# Altium project AirPurity.PrjPcb
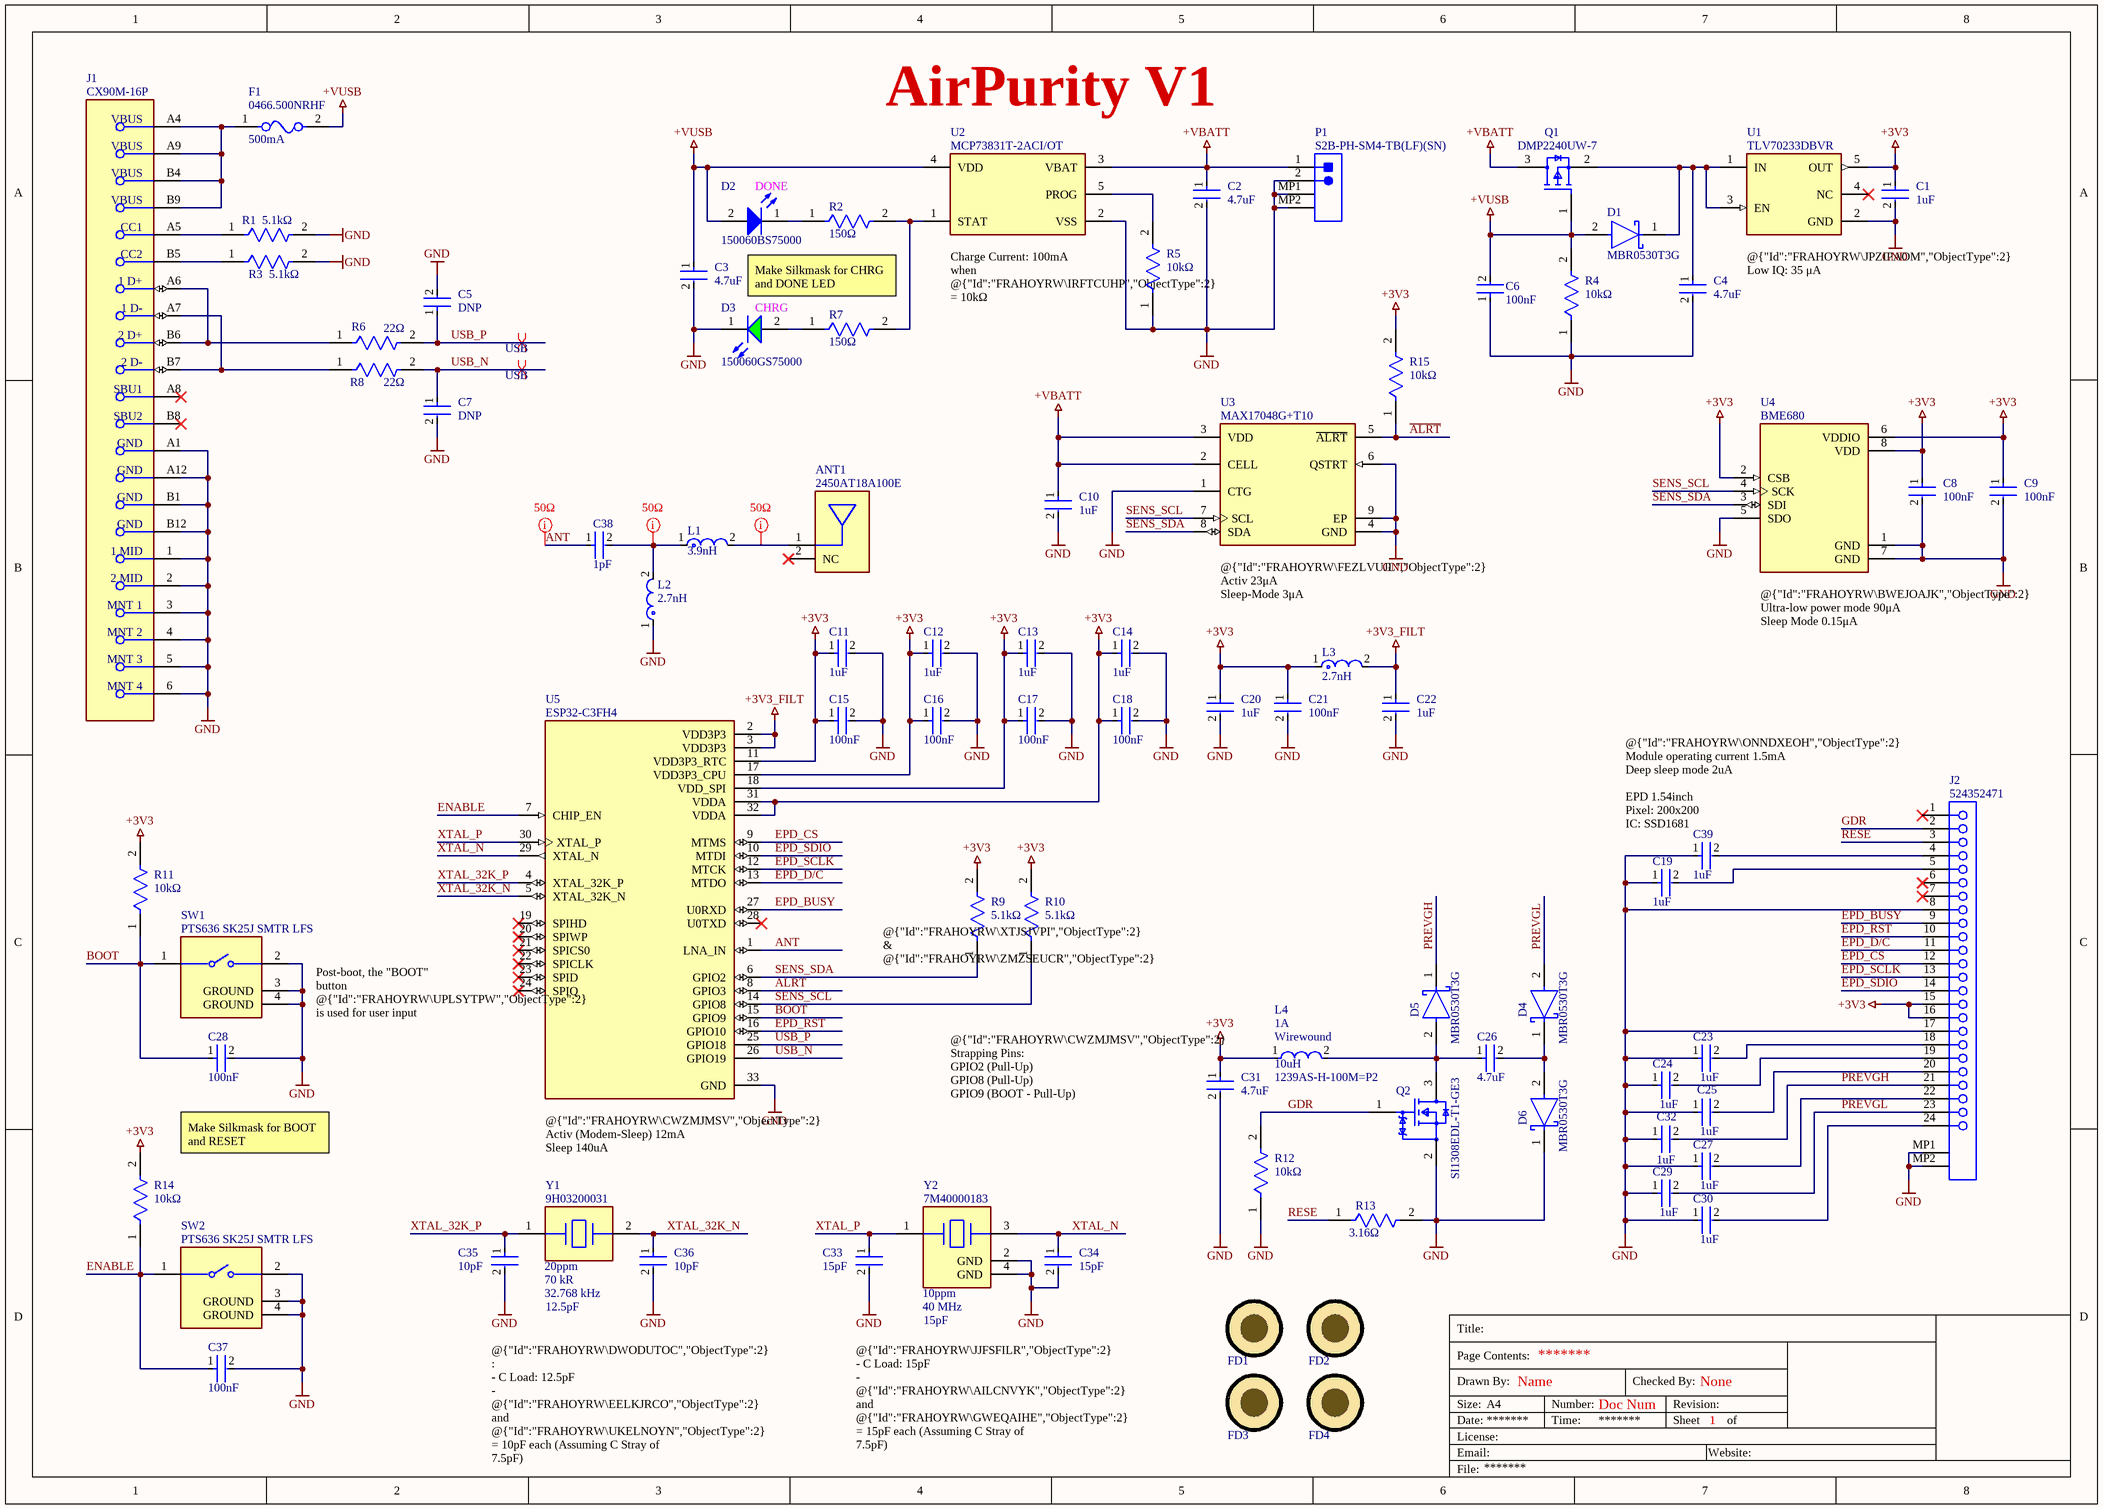
[diagram p0: AirPurity_V1.SchDoc]
1 sheet, 84 parts. Net scope: global (net labels, ports and power ports of the same name join across sheets).
Board file: AirPurity.PcbDoc

## Sheet AirPurity_V1.SchDoc: AirPurity V1
size A3; Date: *******; ApprovedBy: *******; CheckedBy: None; Author: Annoyedmilk; CompanyName: *******; DrawnBy: Name; Engineer: *******; Organization: *******; Address1: *******; Address2: *******; Address3: *******; Address4: *******; DocumentNumber: Doc Num; Revision: *******; SheetNumber: 1; SheetTotal: 1; CurrentTime: *******; CurrentDate: *******; DocumentFullPathAndName: *******; DocumentName: *******; ModifiedDate: *******; ImagePath: C:\Users\marco\Documents\GitHub\AirPurity\logo\AirPurity; ProjectName: *******; Application_BuildNumber: *******

### Parts
ANT1  Manufacturer Part Number: 2450AT18A100E  [FP-2450AT18A0100001E-MFG]  (hidden comment: 2450AT18A100)
C1  Capacitance: 1uF  [GRM155-0402-MFG]  (hidden comment: GRM155R61E105KA12D)
C2  Capacitance: 4.7uF  [GRM155-0402-MFG]  (hidden comment: GRM155R61E475ME15D)
C3  Capacitance: 4.7uF  [GRM155-0402-MFG]  (hidden comment: GRM155R61E475ME15D)
C4  Capacitance: 4.7uF  [GRM155-0402-MFG]  (hidden comment: GRM155R61E475ME15D)
C5  Capacitance: DNP  [GRM033-0201-MFG]  (hidden comment: GRM0335C1H150FA01D)
C6  Capacitance: 100nF  [GRM033-0201-MFG]  (hidden comment: GRM033R61A104KE15D)
C7  Capacitance: DNP  [GRM033-0201-MFG]  (hidden comment: GRM0335C1H150FA01D)
C8  Capacitance: 100nF  [GRM033-0201-MFG]  (hidden comment: GRM033R61A104KE15D)
C9  Capacitance: 100nF  [GRM033-0201-MFG]  (hidden comment: GRM033R61A104KE15D)
C10  Capacitance: 1uF  [GRM155-0402-MFG]  (hidden comment: GRM155R61E105KA12D)
C11  Capacitance: 1uF  [GRM155-0402-MFG]  (hidden comment: GRM155R61E105KA12D)
C12  Capacitance: 1uF  [GRM155-0402-MFG]  (hidden comment: GRM155R61E105KA12D)
C13  Capacitance: 1uF  [GRM155-0402-MFG]  (hidden comment: GRM155R61E105KA12D)
C14  Capacitance: 1uF  [GRM155-0402-MFG]  (hidden comment: GRM155R61E105KA12D)
C15  Capacitance: 100nF  [GRM033-0201-MFG]  (hidden comment: GRM033R61A104KE15D)
C16  Capacitance: 100nF  [GRM033-0201-MFG]  (hidden comment: GRM033R61A104KE15D)
C17  Capacitance: 100nF  [GRM033-0201-MFG]  (hidden comment: GRM033R61A104KE15D)
C18  Capacitance: 100nF  [GRM033-0201-MFG]  (hidden comment: GRM033R61A104KE15D)
C19  Capacitance: 1uF  [GRM155-0402-MFG]  (hidden comment: GRM155R61E105KA12D)
C20  Capacitance: 1uF  [GRM155-0402-MFG]  (hidden comment: GRM155R61E105KA12D)
C21  Capacitance: 100nF  [GRM033-0201-MFG]  (hidden comment: GRM033R61A104KE15D)
C22  Capacitance: 1uF  [GRM155-0402-MFG]  (hidden comment: GRM155R61E105KA12D)
C23  Capacitance: 1uF  [GRM155-0402-MFG]  (hidden comment: GRM155R61E105KA12D)
C24  Capacitance: 1uF  [GRM155-0402-MFG]  (hidden comment: GRM155R61E105KA12D)
C25  Capacitance: 1uF  [GRM155-0402-MFG]  (hidden comment: GRM155R61E105KA12D)
C26  Capacitance: 4.7uF  [GRM155-0402-MFG]  (hidden comment: GRM155R61E475ME15D)
C27  Capacitance: 1uF  [GRM155-0402-MFG]  (hidden comment: GRM155R61E105KA12D)
C28  Capacitance: 100nF  [GRM033-0201-MFG]  (hidden comment: GRM033R61A104KE15D)
C29  Capacitance: 1uF  [GRM155-0402-MFG]  (hidden comment: GRM155R61E105KA12D)
C30  Capacitance: 1uF  [GRM155-0402-MFG]  (hidden comment: GRM155R61E105KA12D)
C31  Capacitance: 4.7uF  [GRM155-0402-MFG]  (hidden comment: GRM155R61E475ME15D)
C32  Capacitance: 1uF  [GRM155-0402-MFG]  (hidden comment: GRM155R61E105KA12D)
C33  Capacitance: 15pF  [GRM033-0201-MFG]  (hidden comment: GRM0335C1H150FA01D)
C34  Capacitance: 15pF  [GRM033-0201-MFG]  (hidden comment: GRM0335C1H150FA01D)
C35  Capacitance: 10pF  [GRM033-0201-MFG]  (hidden comment: GRM0335C1H100JA01D)
C36  Capacitance: 10pF  [GRM033-0201-MFG]  (hidden comment: GRM0335C1H100JA01D)
C37  Capacitance: 100nF  [GRM033-0201-MFG]  (hidden comment: GRM033R61A104KE15D)
C38  Capacitance: 1pF  [GRM033-0201-MFG]  (hidden comment: GRM0335C1H1R0BA01D)
C39  Capacitance: 1uF  [GRM155-0402-MFG]  (hidden comment: GRM155R61E105KA12D)
D1  MBR0530T3G  [425-04-MFG]
D2  150060BS75000  [0603_150060xx75000]
D3  150060GS75000  [0603_150060xx75000]
D4  MBR0530T3G  [425-04-MFG]
D5  MBR0530T3G  [425-04-MFG]
D6  MBR0530T3G  [425-04-MFG]
F1  Current: 500mA  [0466-MFG]  (hidden comment: 0466.500NRHF)
FD1  Fiducial  [FIDUCIAL-1MM]  (value not drawn)
FD2  Fiducial  [FIDUCIAL-1MM]  (value not drawn)
FD3  Fiducial  [FIDUCIAL-1MM]  (value not drawn)
FD4  Fiducial  [FIDUCIAL-1MM]  (value not drawn)
J1  CX90M-16P  [CX90M-16P-MFG]
J2  524352471  [52435-2471]
L1  Inductance: 3.9nH  [LQP03TG-MFG]  (hidden comment: LQP03TN3N9B02D)
L2  Inductance: 2.7nH  [LQP03TG-MFG]  (hidden comment: LQP03TG2N7C02D)
L3  Inductance: 2.7nH  [LQP03TG-MFG]  (hidden comment: LQP03TG2N7C02D)
L4  Current Rating: 1A  Resistor Type: Wirewound  Inductance: 10uH  [DFE252012C-MFG]  (hidden comment: 1239AS-H-100M=P2)
P1  S2B-PH-SM4-TB(LF)(SN)  [JST- S2B-PH-SM4-TB(LF)(SN)]
Q1  DMP2240UW-7  [SOT323-MFG]
Q2  SI1308EDL-T1-GE3  [5549-MFG]
R1  Resistance: 5.1kΩ  [RC0402-MFG]  (hidden comment: RC0402FR-075K1L)
R2  Resistance: 150Ω  [RC0402-MFG]  (hidden comment: RC0402FR-07150RL)
R3  Resistance: 5.1kΩ  [RC0402-MFG]  (hidden comment: RC0402FR-075K1L)
R4  Resistance: 10kΩ  [RC0402-MFG]  (hidden comment: RC0402FR-0710KL)
R5  Resistance: 10kΩ  [RC0402-MFG]  (hidden comment: RC0402FR-0710KL)
R6  Resistance: 22Ω  [RC0402-MFG]  (hidden comment: RC0402FR-0722RL)
R7  Resistance: 150Ω  [RC0402-MFG]  (hidden comment: RC0402FR-07150RL)
R8  Resistance: 22Ω  [RC0402-MFG]  (hidden comment: RC0402FR-0722RL)
R9  Resistance: 5.1kΩ  [RC0402-MFG]  (hidden comment: RC0402FR-075K1L)
R10  Resistance: 5.1kΩ  [RC0402-MFG]  (hidden comment: RC0402FR-075K1L)
R11  Resistance: 10kΩ  [RC0402-MFG]  (hidden comment: RC0402FR-0710KL)
R12  Resistance: 10kΩ  [RC0402-MFG]  (hidden comment: RC0402FR-0710KL)
R13  Resistance: 3.16Ω  [RC0402-MFG]  (hidden comment: RC0402FR-073R16L)
R14  Resistance: 10kΩ  [RC0402-MFG]  (hidden comment: RC0402FR-0710KL)
R15  Resistance: 10kΩ  [RC0402-MFG]  (hidden comment: RC0402FR-0710KL)
SW1  PTS636 SK25J SMTR LFS  [PTS636_SKG25_SMTR_LFS-MFG]
SW2  PTS636 SK25J SMTR LFS  [PTS636_SKG25_SMTR_LFS-MFG]
U1  TLV70233DBVR  [DBV0005A-MFG]
U2  MCP73831T-2ACI/OT  [SOT23-5LD-PL-1-MFG]
U3  MAX17048G+T10  [T822-3-MFG]
U4  BME680  [PSON80P300X300X100-8N]
U5  ESP32-C3FH4  [QFN50P500X500X90-33N]
Y1  Frequency Tolerance: 20ppm  Equivalent Series Resistance: 70 kR  Frequency: 32.768 kHz  Load Capacitance: 12.5pF  [ABS10]  (hidden comment: 9H03200031)
Y2  Frequency Tolerance: 10ppm  Frequency: 40 MHz  Load Capacitance: 15pF  [ABM8]  (hidden comment: 7M40000183)

### Nets
+3V3: C1.1 C8.1 C9.1 C11.1 C12.1 C13.1 C14.1 C15.1 C16.1 C17.1 C18.1 C20.1 C21.1 C31.1 J2.15 J2.16 L3.1 L4.1 R9.2 R10.2 R11.2 R14.2 R15.2 U1.5(OUT) U4.2(CSB) U4.6(VDDIO) U4.8(VDD) U5.11(VDD3P3_RTC) U5.17(VDD3P3_CPU) U5.18(VDD_SPI) U5.31(VDDA) U5.32(VDDA)
+3V3_FILT: C22.1 L3.2 U5.2(VDD3P3) U5.3(VDD3P3)
+VBATT: C2.1 C10.1 P1.1 Q1.3(D) U2.3(VBAT) U3.2(CELL) U3.3(VDD)
+VUSB: C3.1 C6.2 D1.2(A) D2.2(A) F1.2 Q1.1(G) R4.2 U2.4(VDD)
GND: C1.2 C2.2 C3.2 C4.2 C5.2 C6.1 C7.2 C8.2 C9.2 C10.2 C11.2 C12.2 C13.2 C14.2 C15.2 C16.2 C17.2 C18.2 C19.1 C20.2 C21.2 C22.2 C23.1 C24.1 C25.1 C27.1 C28.2 C29.1 C30.1 C31.2 C32.1 C33.2 C34.2 C35.2 C36.2 C37.2 C39.1 D3.1(K) D6.1(C) J1.1(1_MID) J1.2(2_MID) J1.3(MNT_1) J1.4(MNT_2) J1.5(MNT_3) J1.6(MNT_4) J1.A1(GND) J1.A12(GND) J1.B1(GND) J1.B12(GND) J2.8 J2.17 J2.MP1 J2.MP2 L2.1 P1.2 P1.MP1 P1.MP2 Q2.2(S) R1.2 R3.2 R4.1 R5.1 R12.1 R13.2 SW1.2 SW1.3(GROUND) SW1.4(GROUND) SW2.2 SW2.3(GROUND) SW2.4(GROUND) U1.2(GND) U2.2(VSS) U3.1(CTG) U3.4(GND) U3.6(QSTRT) U3.9(EP) U4.1(GND) U4.5(SDO) U4.7(GND) U5.33(GND) Y2.2(GND) Y2.4(GND)
~{ALRT}: R15.1 U3.5(~{ALRT}) U5.8(GPIO3)
ANT: C38.1 U5.1(LNA_IN)
BOOT: C28.1 R11.1 SW1.1 U5.15(GPIO9)
ENABLE: C37.1 R14.1 SW2.1 U5.7(CHIP_EN)
EPD_BUSY: J2.9 U5.27(U0RXD)
EPD_CS: J2.12 U5.9(MTMS)
EPD_D/C: J2.11 U5.13(MTDO)
EPD_RST: J2.10 U5.16(GPIO10)
EPD_SCLK: J2.13 U5.12(MTCK)
EPD_SDIO: J2.14 U5.10(MTDI)
GDR: J2.2 Q2.1(G) R12.2
PREVGH: C32.2 D5.1(C) J2.21
PREVGL: C29.2 D4.2(A) J2.23
RESE: J2.3 R13.1
SENS_SCL: R10.1 U3.7(SCL) U4.4(SCK) U5.14(GPIO8)
SENS_SDA: R9.1 U3.8(SDA) U4.3(SDI) U5.6(GPIO2)
USB_N: C7.1 R8.2 U5.26(GPIO19)
USB_P: C5.1 R6.2 U5.25(GPIO18)
XTAL_32K_N: C36.1 U5.5(XTAL_32K_N) Y1.2
XTAL_32K_P: C35.1 U5.4(XTAL_32K_P) Y1.1
XTAL_N: C34.1 U5.29(XTAL_N) Y2.3
XTAL_P: C33.1 U5.30(XTAL_P) Y2.1
NetANT1_1: ANT1.1(FEED) L1.2
NetC4_1: C4.1 D1.1(C) Q1.2(S) U1.1(IN) U1.3(EN)
NetC19_2: C19.2 J2.5
NetC23_2: C23.2 J2.18
NetC24_2: C24.2 J2.19
NetC25_2: C25.2 J2.20
NetC26_1: C26.1 D5.2(A) L4.2 Q2.3(D)
NetC26_2: C26.2 D4.1(C) D6.2(A)
NetC27_2: C27.2 J2.22
NetC30_2: C30.2 J2.24
NetC38_2: C38.2 L1.1 L2.2
NetC39_2: C39.2 J2.4
NetD2_1: D2.1(K) R2.1
NetD3_2: D3.2(A) R7.1
NetF1_1: F1.1 J1.A4(VBUS) J1.A9(VBUS) J1.B4(VBUS) J1.B9(VBUS)
NetJ1_A5: J1.A5(CC1) R1.1
NetJ1_A6: J1.A6(1_D+) J1.B6(2_D+) R6.1
NetJ1_A7: J1.A7(1_D-) J1.B7(2_D-) R8.1
NetJ1_B5: J1.B5(CC2) R3.1
NetR2_2: R2.2 R7.2 U2.1(STAT)
NetR5_2: R5.2 U2.5(PROG)

Not connected (* = marked no-connect by the designer): ANT1 2(NC)*; J1 A8(SBU1)* B8(SBU2)*; J2 1* 6* 7*; U1 4(NC)*; U5 19(SPIHD)* 20(SPIWP)* 21(SPICS0)* 22(SPICLK)* 23(SPID)* 24(SPIQ)* 28(U0TXD)*

### Layout directives
differential pair; differential pair class USB: USB_N, USB_P
net class 50Ohm: ANT, NetANT1_1, NetC38_2

### Notes on the sheet
- (near D2) DONE
- Make Silkmask for CHRG and DONE LED
- (near D3) CHRG
- (near U2) Charge Current: 100mA
  when @{"Id":"FRAHOYRW\IRFTCUHP","ObjectType":2} = 10kΩ
- (near U1) @{"Id":"FRAHOYRW\JPZIPAOM","ObjectType":2}
  Low IQ: 35 μA
- (near U3) @{"Id":"FRAHOYRW\FEZLVUJL","ObjectType":2}
  Activ 23μA Sleep-Mode 3μA
- (near U4) @{"Id":"FRAHOYRW\BWEJOAJK","ObjectType":2}
  Ultra-low power mode 90μA Sleep Mode 0.15μA
- (near C39) @{"Id":"FRAHOYRW\ONNDXEOH","ObjectType":2}
  Module operating current 1.5mA
  Deep sleep mode 2uA
  EPD 1.54inch
  Pixel: 200x200
  IC: SSD1681
- (near R9) @{"Id":"FRAHOYRW\XTJSJVPI","ObjectType":2} & @{"Id":"FRAHOYRW\ZMZSEUCR","ObjectType":2} I2C Pull-Up
- Post-boot, the "BOOT" button @{"Id":"FRAHOYRW\UPLSYTPW","ObjectType":2} is used for user input
- @{"Id":"FRAHOYRW\CWZMJMSV","ObjectType":2}
  Strapping Pins:
  GPIO2 (Pull-Up)
  GPIO8 (Pull-Up)
  GPIO9 (BOOT - Pull-Up)
- Make Silkmask for BOOT and RESET
- (near U5) @{"Id":"FRAHOYRW\CWZMJMSV","ObjectType":2}
  Activ (Modem-Sleep) 12mA
  Sleep 140uA
- @{"Id":"FRAHOYRW\DWODUTOC","ObjectType":2} :
  - C Load: 12.5pF
  - @{"Id":"FRAHOYRW\EELKJRCO","ObjectType":2} and @{"Id":"FRAHOYRW\UKELNOYN","ObjectType":2} = 10pF each (Assuming C Stray of 7.5pF)
- @{"Id":"FRAHOYRW\JJFSFILR","ObjectType":2}
  - C Load: 15pF
  - @{"Id":"FRAHOYRW\AILCNVYK","ObjectType":2} and @{"Id":"FRAHOYRW\GWEQAIHE","ObjectType":2} = 15pF each (Assuming C Stray of 7.5pF)
- Title:
- Drawn By:
- Page Contents:
- Checked By:
- Size:
- Date:
- File:
- License:
- Email:
- A4
- Number:
- Time:
- Revision:
- Sheet
- Website:
- of

### Library data of the parts
ANT1 = 2450AT18A100: Chip Antenna 0.5dBi 2.4GHz 2W 1206; Impedance: 50Ω; LCSC Part Number: C89334
C1 C10-C14 C19 C20 C22-C25 C27 C29 C30 C32 C39 = GRM155R61E105KA12D: 1uF X5R 0402 Multilayer Ceramic Capacitor; LCSC Part Number: C77009; Manufacturer Part Number: GRM155R61E105KA12D
C2-C4 C26 C31 = GRM155R61E475ME15D: 4.7uF X5R 0402 Multilayer Ceramic Capacitor; LCSC Part Number: C2858031; Manufacturer Part Number: GRM155R61E475ME15D
C5 C7 C33 C34 = GRM0335C1H150FA01D: 15pF C0G 0201 Multilayer Ceramic Capacitor; LCSC Part Number: C237567; Manufacturer Part Number: GRM0335C1H150FA01D
C6 C8 C9 C15-C18 C21 C28 C37 = GRM033R61A104KE15D: 100nF X5R 0201 Multilayer Ceramic Capacitor; LCSC Part Number: C76934; Manufacturer Part Number: GRM033R61A104KE15D
C35 C36 = GRM0335C1H100JA01D: 10pF C0G 0201 Multilayer Ceramic Capacitor; LCSC Part Number: C76921; Manufacturer Part Number: GRM0335C1H100JA01D
C38 = GRM0335C1H1R0BA01D: 1pF C0G 0201 Multilayer Ceramic Capacitor; LCSC Part Number: C85893; Manufacturer Part Number: GRM0335C1H1R0BA01D
D1 D4-D6 = MBR0530T3G: Schottky Barrier Diodes; LCSC Part Number: C236079; Manufacturer Part Number: MBR0530T3G
D2 = 150060BS75000: LED Blue 3.2V 0603; Forward Voltage: 3.2V; Color: Blue; LCSC Part Number: C5197644; Manufacturer Part Number: 150060BS75000
D3 = 150060GS75000: LED Emerald 3.2V 0603; Color: Green; Forward Voltage: 3.2V; LCSC Part Number: C5252984; Manufacturer Part Number: 150060GS75000
F1 = 0466.500NRHF: Fuse 500mA; LCSC Part Number: C151133; Manufacturer Part Number: 0466.500NRHF
J1 = CX90M-16P: Connector USB2.0 TYPE-C 16POS; LCSC Part Number: C2889324; Manufacturer Part Number: CX90M-16P
J2 = 524352471: FPC Connector, 2.0 mm, 0.5 mm, Right Angle; LCSC Part Number: C122394; Manufacturer Part Number: 524352471
L1 = LQP03TN3N9B02D: Inductor 3.9nH; Current Rating: 400mA; LCSC Part Number: C77115; Manufacturer Part Number: LQP03TN3N9B02D
L2 L3 = LQP03TG2N7C02D: Inductor 2.7nH; Current Rating: 450mA; LCSC Part Number: C337946; Manufacturer Part Number: LQP03TG2N7C02D
L4 = 1239AS-H-100M=P2: Inductor 10uH; LCSC Part Number: C237599; Manufacturer Part Number: 1239AS-H-100M=P2
P1 = S2B-PH-SM4-TB(LF)(SN): Male Header, Pitch 2 mm, 1 x 2 Position; LCSC Part Number: C295747; Manufacturer Part Number: S2B-PH-SM4-TB(LF)(SN)
Q1 = DMP2240UW-7: MOSFET P-Channel; LCSC Part Number: C459548; Manufacturer Part Number: DMP2240UW-7
Q2 = SI1308EDL-T1-GE3: MOSFET N-Channel; LCSC Part Number: C469327; Manufacturer Part Number: SI1308EDL-T1-GE3
R1 R3 R9 R10 = RC0402FR-075K1L: 5.1kΩ 0402 Chip Resistor; LCSC Part Number: C105872; Manufacturer Part Number: RC0402FR-075K1L
R2 R7 = RC0402FR-07150RL: 150Ω 0402 Chip Resistor; LCSC Part Number: C138054; Manufacturer Part Number: RC0402FR-07150RL
R4 R5 R11 R12 R14 R15 = RC0402FR-0710KL: 10kΩ 0402 Chip Resistor; LCSC Part Number: C60490; Manufacturer Part Number: RC0402FR-0710KL
R6 R8 = RC0402FR-0722RL: 22Ω 0402 Chip Resistor; LCSC Part Number: C114765; Manufacturer Part Number: RC0402FR-0722RL
R13 = RC0402FR-073R16L: 3.16Ω 0402 Chip Resistor; LCSC Part Number: C477688; Manufacturer Part Number: RC0402FR-073R16L
SW1 SW2 = PTS636 SK25J SMTR LFS: Tactile Switch SPST; LCSC Part Number: C2800965; Manufacturer Part Number: PTS636 SK25J SMTR LFS
U1 = TLV70233DBVR: LDO Voltage Regulators 300mALow IQLDO Reg; LCSC Part Number: C26833; Manufacturer Part Number: TLV70233DBVR
U2 = MCP73831T-2ACI/OT: IC Controller LI-ION 4.2V; LCSC Part Number: C424093; Manufacturer Part Number: MCP73831T-2ACI/OT
U3 = MAX17048G+T10: Fuel Gauge LI-ION; LCSC Part Number: C2682616; Manufacturer Part Number: MAX17048G+T10
U4 = BME680: Gas, Humidity, Pressure, Temperature Sensor I²C; LCSC Part Number: C125972; Manufacturer Part Number: BME680
U5 = ESP32-C3FH4: Bluetooth, WiFi 802.11b/g/n, Bluetooth v5.0 Transceiver Module 2.402GHz ~ 2.48GHz Antenna Not Included Surface Mount; LCSC Part Number: C2858491; Manufacturer Part Number: ESP32-C3FH4
Y1 = 9H03200031: Crystal 32.768 kHz; LCSC Part Number: C90944; Manufacturer Part Number: 9H03200031
Y2 = 7M40000183: Crystal 40 MHz; LCSC Part Number: C331598; Manufacturer Part Number: 7M40000183